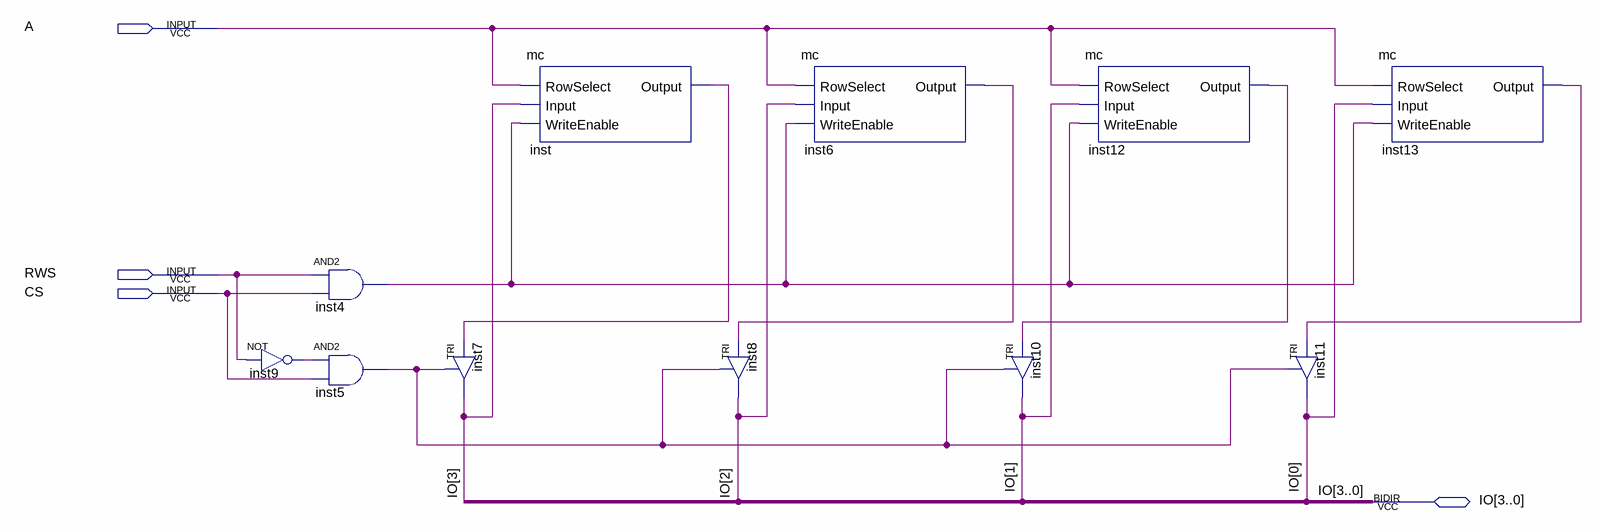
[diagram p0: schematic sheet]
// Quartus schematic ram.bdf as structural Verilog: 11 symbols, 4 pins
module ram (
  input  A,
  input  RWS,
  input  CS,
  inout  [3:0] IO
);

  wire inst4_out, inst5_out, inst6_output, inst9_out, inst12_output, inst13_output, inst_output;

  not inst9 (inst9_out, RWS);
  and inst4 (inst4_out, RWS, CS);
  and inst5 (inst5_out, inst9_out, CS);
  TRI inst7 (.IN(inst_output), .OE(inst5_out), .OUT(IO[3]));
  mc inst (.RowSelect(A), .Input(IO[3]), .WriteEnable(inst4_out), .Output(inst_output));
  TRI inst8 (.IN(inst6_output), .OE(inst5_out), .OUT(IO[2]));
  mc inst6 (.RowSelect(A), .Input(IO[2]), .WriteEnable(inst4_out), .Output(inst6_output));
  TRI inst10 (.IN(inst12_output), .OE(inst5_out), .OUT(IO[1]));
  mc inst12 (.RowSelect(A), .Input(IO[1]), .WriteEnable(inst4_out), .Output(inst12_output));
  TRI inst11 (.IN(inst13_output), .OE(inst5_out), .OUT(IO[0]));
  mc inst13 (.RowSelect(A), .Input(IO[0]), .WriteEnable(inst4_out), .Output(inst13_output));
endmodule
